# Altium schematic sheet STM32 Home Automation.SchDoc
size C
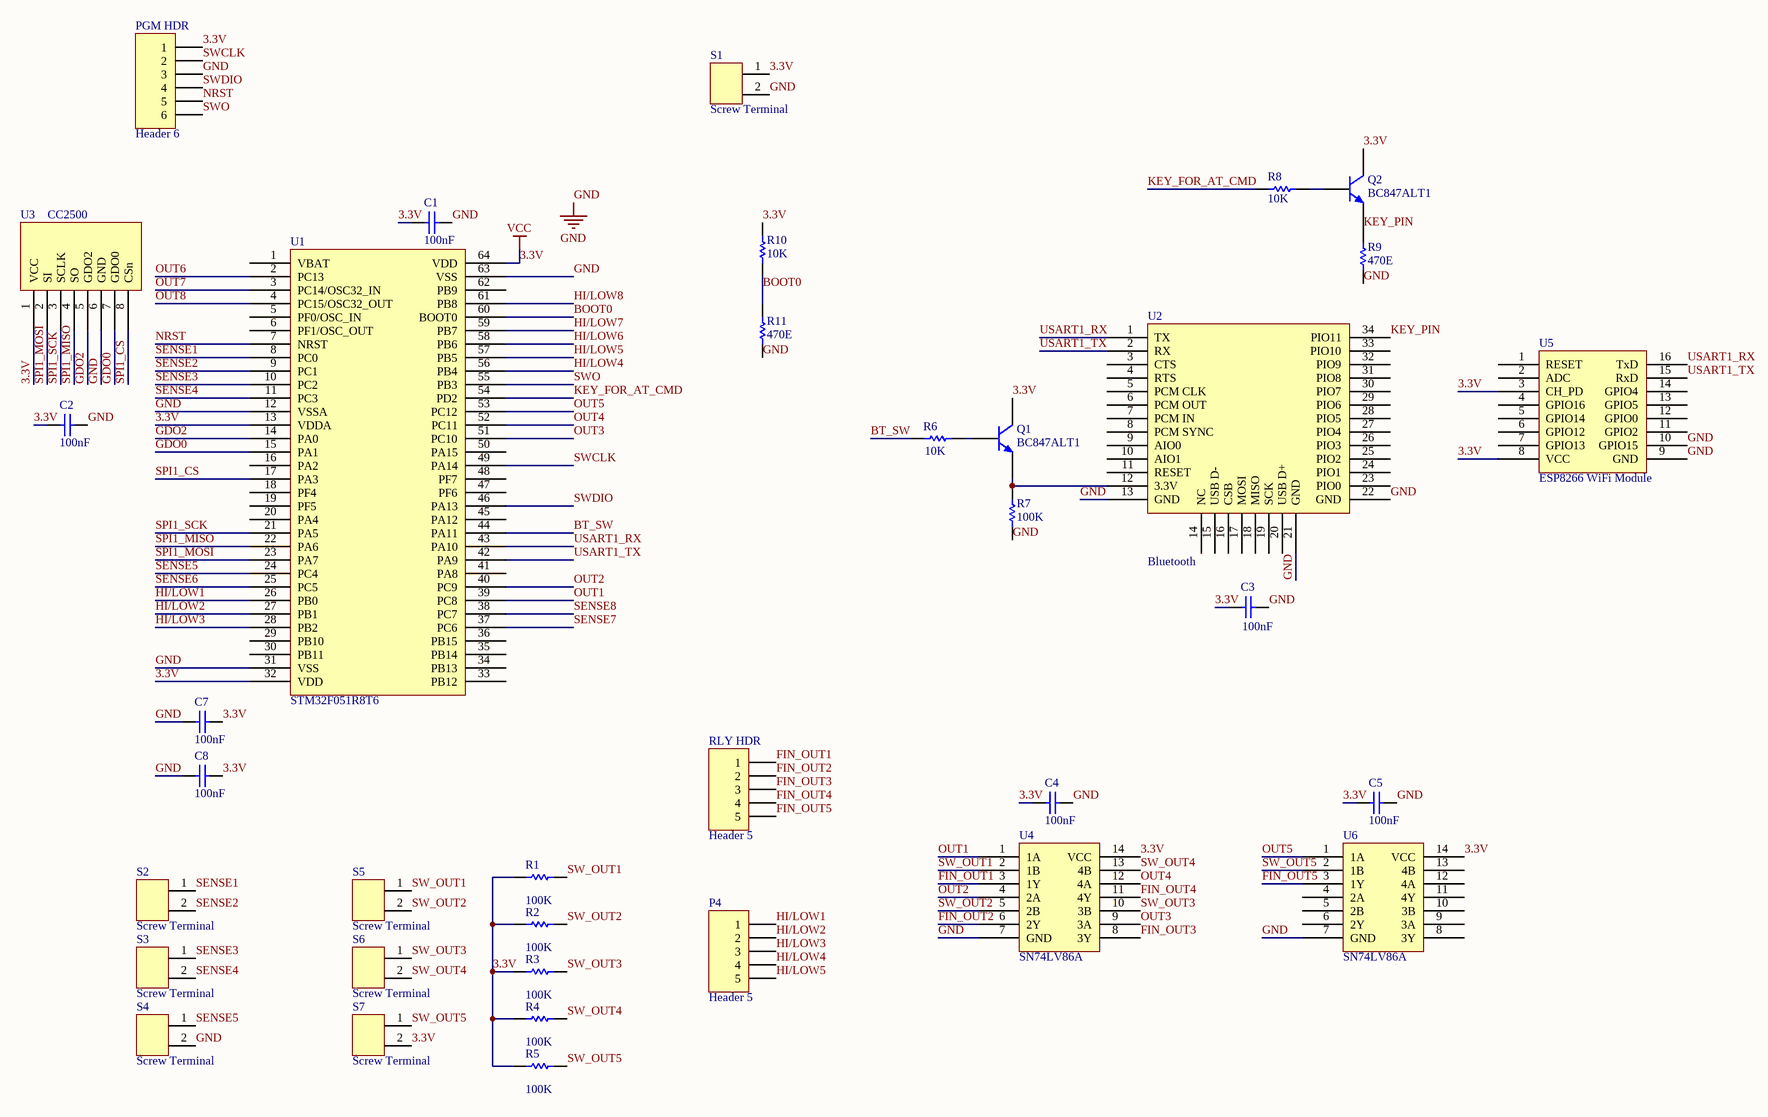
[diagram p0: STM32 Home Automation.SchDoc]

## Parts
C1  100nF  [0805]
C2  100nF  [0805]
C3  100nF  [0805]
C4  100nF  [0805]
C5  100nF  [0805]
C7  100nF  [0805]
C8  100nF  [0805]
P4  Header 5  [HDR1X5]
PGM_HDR  Header 6  [HDR1X6]
Q1  BC847ALT1  [318-08]
Q2  BC847ALT1  [318-08]
R1  100K  [ERA-0805]
R2  100K  [ERA-0805]
R3  100K  [ERA-0805]
R4  100K  [ERA-0805]
R5  100K  [ERA-0805]
R6  10K  [ERA-0805]
R7  100K  [ERA-0805]
R8  10K  [ERA-0805]
R9  470E  [ERA-0805]
R10  10K  [ERA-0805]
R11  470E  [ERA-0805]
RLY_HDR  Header 5  [HDR1X5]
S1  Screw Terminal  [Screw Terminal]
S2  Screw Terminal  [Screw Terminal]
S3  Screw Terminal  [Screw Terminal]
S4  Screw Terminal  [Screw Terminal]
S5  Screw Terminal  [Screw Terminal]
S6  Screw Terminal  [Screw Terminal]
S7  Screw Terminal  [Screw Terminal]
U1  STM32F051R8T6  [STM32F051R8T6]
U2  Bluetooth  [Bluetooth]
U3  CC2500  [CC2500]
U4  SN74LV86A  [SN74LV86A, SOIC127P600X175-14N]
U5  ESP8266 WiFi Module
U6  SN74LV86A  [SN74LV86A, SOIC127P600X175-14N]

## Nets
3.3V: C1.1 C2.1 C3.1 C4.1 C5.1 C7.1 C8.1 PGM_HDR.1 Q1.3(C) Q2.3(C) R1.1 R2.1 R3.1 R4.1 R5.1 R10.1 S1.1 S7.2 U1.13(VDDA) U1.32(VDD) U1.64(VDD) U3.1(VCC) U4.14(VCC) U5.3(CH_PD) U5.8(VCC) U6.14(VCC)  [also labelled VCC]
GND: C1.2 C2.2 C3.2 C4.2 C5.2 C7.2 C8.2 PGM_HDR.3 R7.1 R9.2 R11.2 S1.2 S4.2 U1.12(VSSA) U1.31(VSS) U1.63(VSS) U2.13(GND) U2.21(GND) U2.22(GND) U3.6(GND) U4.7(GND) U5.9(GND) U5.10(GPIO15) U6.7(GND)
BOOT0: R10.2 R11.1 U1.60(BOOT0)
BT_SW: R6.1 U1.44(PA11)
FIN_OUT1: RLY_HDR.1 U4.3(1Y)
FIN_OUT2: RLY_HDR.2 U4.6(2Y)
FIN_OUT3: RLY_HDR.3 U4.8(3Y)
FIN_OUT4: RLY_HDR.4 U4.11(4Y)
FIN_OUT5: RLY_HDR.5 U6.3(1Y)
GDO0: U1.15(PA1) U3.7(GDO0)
GDO2: U1.14(PA0) U3.5(GDO2)
HI/LOW1: P4.1 U1.26(PB0)
HI/LOW2: P4.2 U1.27(PB1)
HI/LOW3: P4.3 U1.28(PB2)
HI/LOW4: P4.4 U1.56(PB4)
HI/LOW5: P4.5 U1.57(PB5)
HI/LOW6: U1.58(PB6)
HI/LOW7: U1.59(PB7)
HI/LOW8: U1.61(PB8)
KEY_FOR_AT_CMD: R8.2 U1.54(PD2)
KEY_PIN: Q2.2(E) R9.1 U2.34(PIO11)
NRST: PGM_HDR.5 U1.7(NRST)
OUT1: U1.39(PC8) U4.1(1A)
OUT2: U1.40(PC9) U4.4(2A)
OUT3: U1.51(PC10) U4.9(3A)
OUT4: U1.52(PC11) U4.12(4A)
OUT5: U1.53(PC12) U6.1(1A)
OUT6: U1.2(PC13)
OUT7: U1.3(PC14/OSC32_IN)
OUT8: U1.4(PC15/OSC32_OUT)
SENSE1: S2.1 U1.8(PC0)
SENSE2: S2.2 U1.9(PC1)
SENSE3: S3.1 U1.10(PC2)
SENSE4: S3.2 U1.11(PC3)
SENSE5: S4.1 U1.24(PC4)
SENSE6: U1.25(PC5)
SENSE7: U1.37(PC6)
SENSE8: U1.38(PC7)
SPI1_CS: U1.17(PA3) U3.8(CSn)
SPI1_MISO: U1.22(PA6) U3.4(SO)
SPI1_MOSI: U1.23(PA7) U3.2(SI)
SPI1_SCK: U1.21(PA5) U3.3(SCLK)
SW_OUT1: R1.2 S5.1 U4.2(1B)
SW_OUT2: R2.2 S5.2 U4.5(2B)
SW_OUT3: R3.2 S6.1 U4.10(3B)
SW_OUT4: R4.2 S6.2 U4.13(4B)
SW_OUT5: R5.2 S7.1 U6.2(1B)
SWCLK: PGM_HDR.2 U1.49(PA14)
SWDIO: PGM_HDR.4 U1.46(PA13)
SWO: PGM_HDR.6 U1.55(PB3)
USART1_RX: U1.43(PA10) U2.1(TX) U5.16(TxD)
USART1_TX: U1.42(PA9) U2.2(RX) U5.15(RxD)
NetQ1_1: Q1.1(B) R6.2
NetQ1_2: Q1.2(E) R7.2 U2.12(3.3V)
NetQ2_1: Q2.1(B) R8.1

Not connected (* = marked no-connect by the designer): U1 1(VBAT) 5(PF0/OSC_IN) 6(PF1/OSC_OUT) 16(PA2) 18(PF4) 19(PF5) 20(PA4) 29(PB10) 30(PB11) 33(PB12) 34(PB13) 35(PB14) 36(PB15) 41(PA8) 45(PA12) 47(PF6) 48(PF7) 50(PA15) 62(PB9); U2 3(CTS) 4(RTS) 5(PCM_CLK) 6(PCM_OUT) 7(PCM_IN) 8(PCM_SYNC) 9(AIO0) 10(AIO1) 11(RESET) 14(NC) 15(USB_D-) 16(CSB) 17(MOSI) 18(MISO) 19(SCK) 20(USB_D+) 23(PIO0) 24(PIO1) 25(PIO2) 26(PIO3) 27(PIO4) 28(PIO5) 29(PIO6) 30(PIO7) 31(PIO8) 32(PIO9) 33(PIO10); U5 1(RESET) 2(ADC) 4(GPIO16) 5(GPIO14) 6(GPIO12) 7(GPIO13) 11(GPIO2) 12(GPIO0) 13(GPIO5) 14(GPIO4); U6 4(2A) 5(2B) 6(2Y) 8(3Y) 9(3A) 10(3B) 11(4Y) 12(4A) 13(4B)

## Library data of the parts
C1-C5 C7 C8 = C0805: Ceramic Chip Capacitor - Standard; Note: Footprint corresponds to dimensions for bulk cassette packaging. This case size has tightened tolerances.; Published: 17-Jul-2002; LatestRevisionDate: 19-Mar-2004; LatestRevisionNote: Silkscreen size reduced.; DatasheetDocument: Mar-2001; PackageDocument: Mar-2001; PackageReference: 0805; Publisher: Altium Limited; Code_JEITA: 0805; Code_IPC: 2012[0805]; ComponentLink1Description: Manufacturer Link; ComponentLink1URL: http://www.kemet.com/; ComponentLink2Description: Datasheet; ComponentLink2URL: http://www.kemet.com/kemet/web/homepage/kechome.nsf/vapubfilesname/F3102TA.pdf/$file/F3102TA.pdf; Value: 100nF
P4 RLY_HDR = Header 5: Header, 5-Pin; LatestRevisionDate: 17-Jul-2002; LatestRevisionNote: Re-released for DXP Platform.; Publisher: Altium Limited
PGM_HDR = Header 6: Header, 6-Pin; LatestRevisionDate: 17-Jul-2002; LatestRevisionNote: Re-released for DXP Platform.; Publisher: Altium Limited
Q1 Q2 = BC847ALT1: General Purpose Transistor NPN Silicon; Published: 29-Sep-2000; LatestRevisionDate: 17-Jul-2002; LatestRevisionNote: Re-released for DXP Platform.; DatasheetVersion: 1997; PackageVersion: 1997; PackageReference: 318-08; Publisher: Altium Limited; PackageDescription: SOT-23; 3 Leads; Body 3.0 x 2.6 mm, inc. leads (LxW max); ComponentLink1Description: Manufacturer Link; ComponentLink1URL: http://www.onsemi.com/site/products/landing?taxonomyID=194; ComponentLink2Description: Datasheet; ComponentLink2URL: http://www.onsemi.com/pub/Collateral/BC846ALT1-D.PDF
R1-R11 = ERA6Y: Rectangular Thick Film Chip Resistor, 10 Ohm to 1M Ohm Range, 0.1% and 0.5% Tolerance, 0805 Size, 0.1 W; Note: If flow soldering, adjust pad width of PCB Footprint to 0.7 - 0.8 times the width of the resistor.; Published: 17-Dec-2003; LatestRevisionDate: 19-Mar-2004; LatestRevisionNote: Silkscreen size reduced.; PackageDocument: Mar-2003; PackageReference: ERA-0805; Publisher: Altium Limited; Code_IPC: 2012 [0805]; ComponentLink1Description: Manufacturer Link; ComponentLink1URL: http://www.panasonic.com/industrial/components/resistive_products.htm; ComponentLink2Description: Datasheet; ComponentLink2URL: http://www.panasonic.com/industrial/components/pdf/AOA0000CE8.pdf
  R1-R5 R7: Value: 100K
  R6 R8 R10: Value: 10K
  R9 R11: Value: 470E